# Altium schematic sheet Sensör.SchDoc
size A4; SheetNumber: 1; SheetTotal: 3
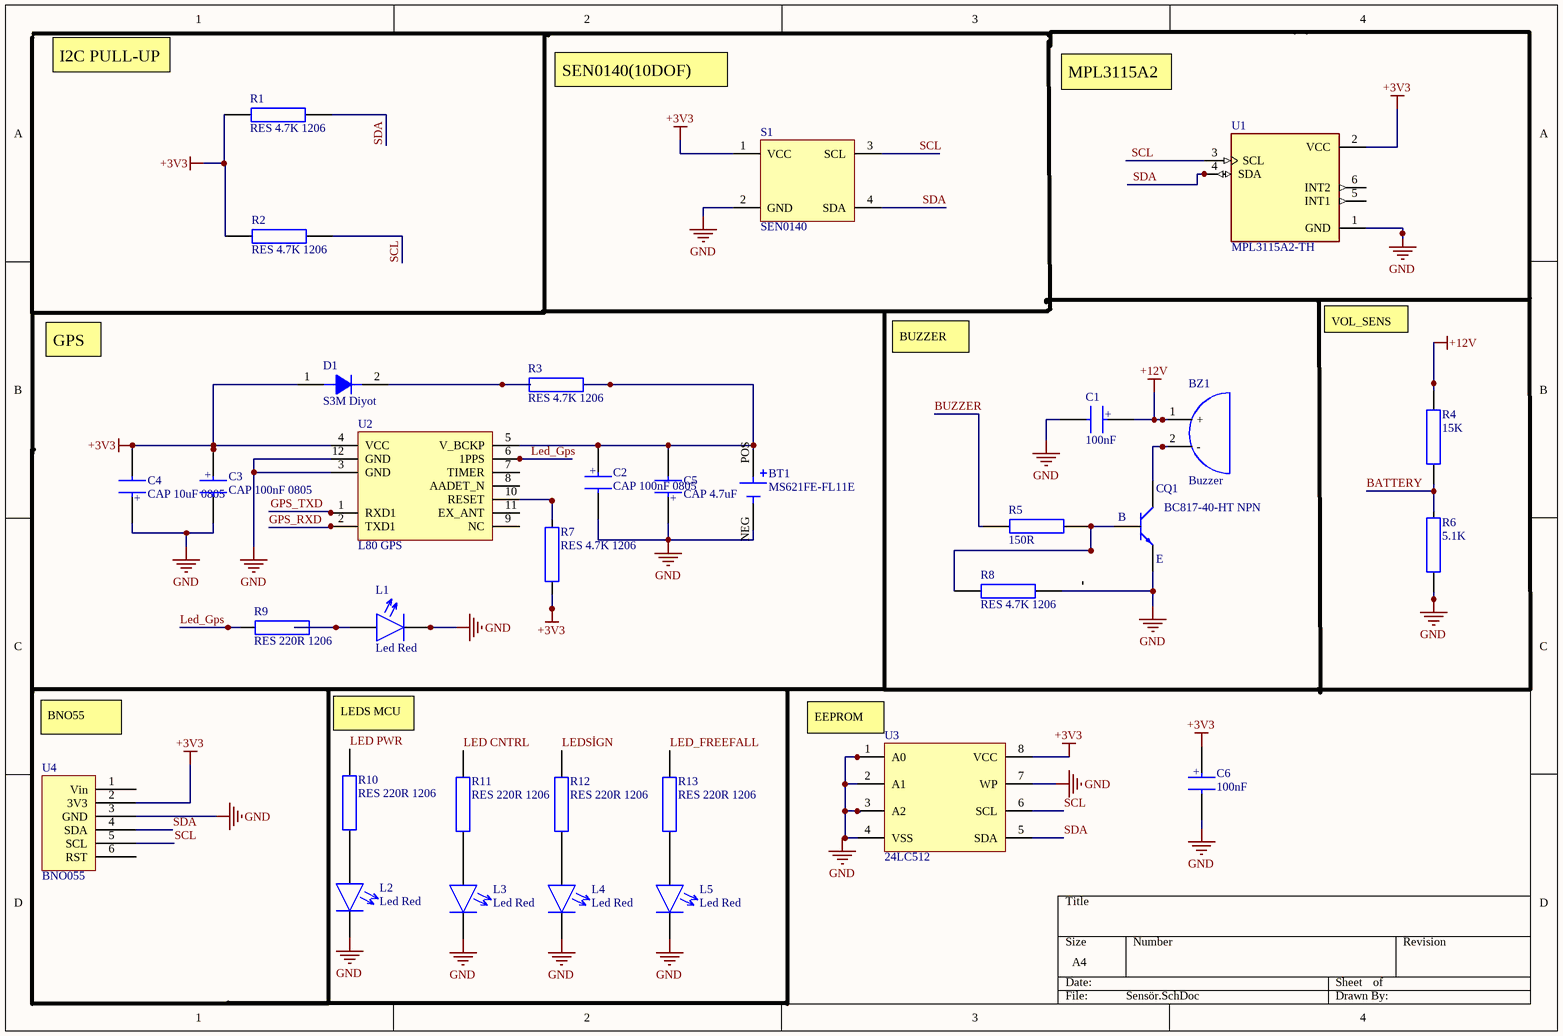
[diagram p0: Sensör.SchDoc]

## Parts
BT1  MS621FE-FL11E  [BAT_MS621FE-FL11E]
BZ1  Buzzer  [CMI-9605IC]
C1  100nF  [CAP_805]
C2  CAP 100nF 0805  [CAP_805]
C3  CAP 100nF 0805  [CAP_805]
C4  CAP 10uF 0805  [CAP_805]
C5  CAP 4.7uF  [CAP_805]
C6  100nF  [CAP_805]
D1  S3M Diyot  [DO214AA]
L1  Led Red  [Led 1206]
L2  Led Red  [Led 1206]
L3  Led Red  [Led 1206]
L4  Led Red  [Led 1206]
L5  Led Red  [Led 1206]
Q1  BC817-40-HT NPN  [SOT-23]
R1  RES 4.7K 1206  [RES_1206]
R2  RES 4.7K 1206  [RES_1206]
R3  RES 4.7K 1206  [RES_1206]
R4  15K  [RES_1206]
R5  150R  [RES_1206]
R6  5.1K  [RES_1206]
R7  RES 4.7K 1206  [RES_1206]
R8  RES 4.7K 1206  [RES_1206]
R9  RES 220R 1206  [RES_1206]
R10  RES 220R 1206  [RES_1206]
R11  RES 220R 1206  [RES_1206]
R12  RES 220R 1206  [RES_1206]
R13  RES 220R 1206  [RES_1206]
S1  SEN0140  [SEN0140]
U1  MPL3115A2-TH  [MPL3115A2]
U2  L80 GPS  [L-80]
U3  24LC512  [soic-8]
U4  BNO055  [BNO055]

## Nets
+3V3: C3.1 C4.2 C6.1 D1.1 R1.2 R2.2 R7.1 S1.1(VCC) U1.2(VCC) U2.4(VCC) U3.8(VCC) U4.2(3V3)
+12V: BZ1.1(+) C1.1 R4.1
GND: BT1.NEG C1.2 C2.2 C3.2 C4.1 C5.1 C6.2 L1.2 L2.2 L3.2 L4.2 L5.2 Q1.2 R6.2 R8.1 S1.2(GND) U1.1(GND) U2.3(GND) U2.12(GND) U3.1(A0) U3.2(A1) U3.3(A2) U3.4(VSS) U3.7(WP) U4.3(GND)
BATTERY: R4.2 R6.1
BUZZER: R5.2
GPS_RXD: U2.2(TXD1)
GPS_TXD: U2.1(RXD1)
LED CNTRL: R11.2
LED PWR: R10.2
LED_FREEFALL: R13.2
Led_Gps: R9.1 U2.6(1PPS)
LEDSİGN: R12.2
SCL: R2.1 S1.3(SCL) U1.3(SCL) U3.6(SCL) U4.5(SCL)
SDA: R1.1 S1.4(SDA) U1.4(SDA) U3.5(SDA) U4.4(SDA)
NetBT1_POS: BT1.POS C2.1 C5.2 R3.2 U2.5(V_BCKP)
NetBZ1_2: BZ1.2(-) Q1.3
NetD1_2: D1.2 R3.1
NetL1_1: L1.1 R9.2
NetL2_1: L2.1 R10.1
NetL3_1: L3.1 R11.1
NetL4_1: L4.1 R12.1
NetL5_1: L5.1 R13.1
NetQ1_1: Q1.1 R5.1 R8.2
NetR7_2: R7.2 U2.10(RESET)

Not connected (* = marked no-connect by the designer): U1 5(INT1) 6(INT2); U2 7(TIMER) 8(AADET_N) 9(NC) 11(EX_ANT); U4 1(Vin) 6(RST)

## Notes on the sheet
- I2C PULL-UP
- SEN0140(10DOF)
- MPL3115A2
- GPS
- BUZZER
- VOL_SENS
- BNO55
- LEDS MCU
- (near U3) EEPROM
- (in symbol BC817-40-HT NPN) C; B; E
- (in symbol CAP 2.2uF) +
- (in symbol CAP 10uF 0805) +
- (in symbol CAP 100nF 0805) +

## Library data of the parts
BT1 = MS621FE-FL11E: Coin, 6.8mm 3V Lithium Battery Rechargeable (Secondary) 5.5mAh; MF: Seiko Instruments; SnapEDA_Link: https://www.snapeda.com/parts/MS621FE-FL11E/Seiko%20Instruments/view-part/6886595/?ref=snap; MP: MS621FE-FL11E; Availability: In Stock; Price: None; Check_prices: https://www.snapeda.com/parts/MS621FE-FL11E/Seiko%20Instruments/view-part/6886595/?ref=eda; Value: *; Purchase-URL: https://pricing.snapeda.com/search/part/MS621FE-FL11E/?ref=eda; Package: QFP-128 Seiko
BZ1 = BUZZER: Designed by: Ahmet Azboy
C1-C3 C6 = CAP 100nF 0805: 0805 smd
C4 = CAP 10uF 0805: 0805 smd
C5 = CAP 2.2uF: 0805 smd
D1 = S3M Diyot: Current: 3A; Voltage: 1000V; Case/Package: DO214AA
Q1 = BC817-40-HT NPN: Current: 500 mA; Voltage: 45V; Case/Package: SOT-23
R4 R6 = RES 1K 1206
R5 = RES 4.7K 1206
S1 = SEN0140: 10 DOF IMU
U2 = L80 GPS: Name: Quetcel L80; Designed By: Ahmet Azboy
U3 = 24LC512: EEPROM Serial-2Wire 512K-bit 64K x 8 3.3V/5V 8-Pin SOIJ Tube / IC EEPROM 512KBIT 400KHZ 8SOIJ; Manufacturer: Microchip; Manufacturer Part Number: 24LC512-I/SM; Access Time: 900ns; Memory Size: 512Kb; Nominal Supply Current: 5mA; Interface: I2C,Serial,2-Wire; Max Supply Voltage: 5.5V; Min Supply Voltage: 2.5V; Organization: 64KX8; Write Protection: YES; Write Cycle Time-Max (tWC): 5ms; Designed by: Ahmet Azboy; Supplier 1: RSComponents; RoHS: Yes; Category: EEPROM; Stock 1: 53; Pricing 1: 90=1,48900 (GBP); Mount: Surface Mount; Case/Package: SOIC; Number of Pins: 8; Min Operating Temperature: -40°C; Max Operating Temperature: 85°C; Packaging: Rail/Tube; Frequency: 400kHz; Density: 512Kb; Package Quantity: 90; Memory Type: EEPROM; Max Frequency: 400kHz; Access Time-Max: 900ns; Supply Current: 5mA; Programming Voltage: 5.5V; Supply Voltage-Nom: 5.5V; Length: 5.21mm; Width: 5.28mm; Height: 1.88mm; Radiation Hardening: No; Lead Free: Lead Free; RoHS Compliant: Yes; REACH SVHC: No SVHC; ComponentLink1URL: https://datasheet.ciiva.com/26870/24lc512-i-sm-26870738.pdf?src-supplier=IIIC; ComponentLink1Description: https://datasheet.ciiva.com/26870/24lc512-i-sm-26870738.pdf?src-supplier=IIIC; ComponentLink2URL: https://datasheet.ciiva.com/29294/160414-da-01-en-eeprom-24lc512-i-sm-microchip-29294348.pdf?src-supplier=Conrad; ComponentLink2Description: https://datasheet.ciiva.com/29294/160414-da-01-en-eeprom-24lc512-i-sm-microchip-29294348.pdf?src-supplier=Conrad; ComponentLink3URL: https://datasheet.ciiva.com/17651/21754m-17651369.pdf?src-supplier=Avnet+Europe; ComponentLink3Description: https://datasheet.ciiva.com/17651/21754m-17651369.pdf?src-supplier=Avnet+Europe; ComponentLink4URL: https://datasheet.ciiva.com/1155/1688094-1155274.pdf?src-supplier=Element14; ComponentLink4Description: https://datasheet.ciiva.com/1155/1688094-1155274.pdf?src-supplier=Element14; ComponentLink5URL: https://datasheet.ciiva.com/1155/1688094-1155275.pdf?src-supplier=Element14; ComponentLink5Description: https://datasheet.ciiva.com/1155/1688094-1155275.pdf?src-supplier=Element14; ComponentLink6URL: https://datasheet.ciiva.com/3184/21754m-3184956.pdf?src-supplier=Avnet; ComponentLink6Description: https://datasheet.ciiva.com/3184/21754m-3184956.pdf?src-supplier=Avnet; ComponentLink7URL: https://datasheet.ciiva.com/16921/70045251-16921949.pdf?src-supplier=Allied+Electronics; ComponentLink7Description: https://datasheet.ciiva.com/16921/70045251-16921949.pdf?src-supplier=Allied+Electronics; ComponentLink8URL: https://datasheet.ciiva.com/16304/filehandler-aspxddocname-en546203-16304574.pdf?src-supplier=Future+Electronics; ComponentLink8Description: https://datasheet.ciiva.com/16304/filehandler-aspxddocname-en546203-16304574.pdf?src-supplier=Future+Electronics; Supplier Part Number 1: 8895724